# Altium schematic sheet Sheet8.SchDoc
size A4
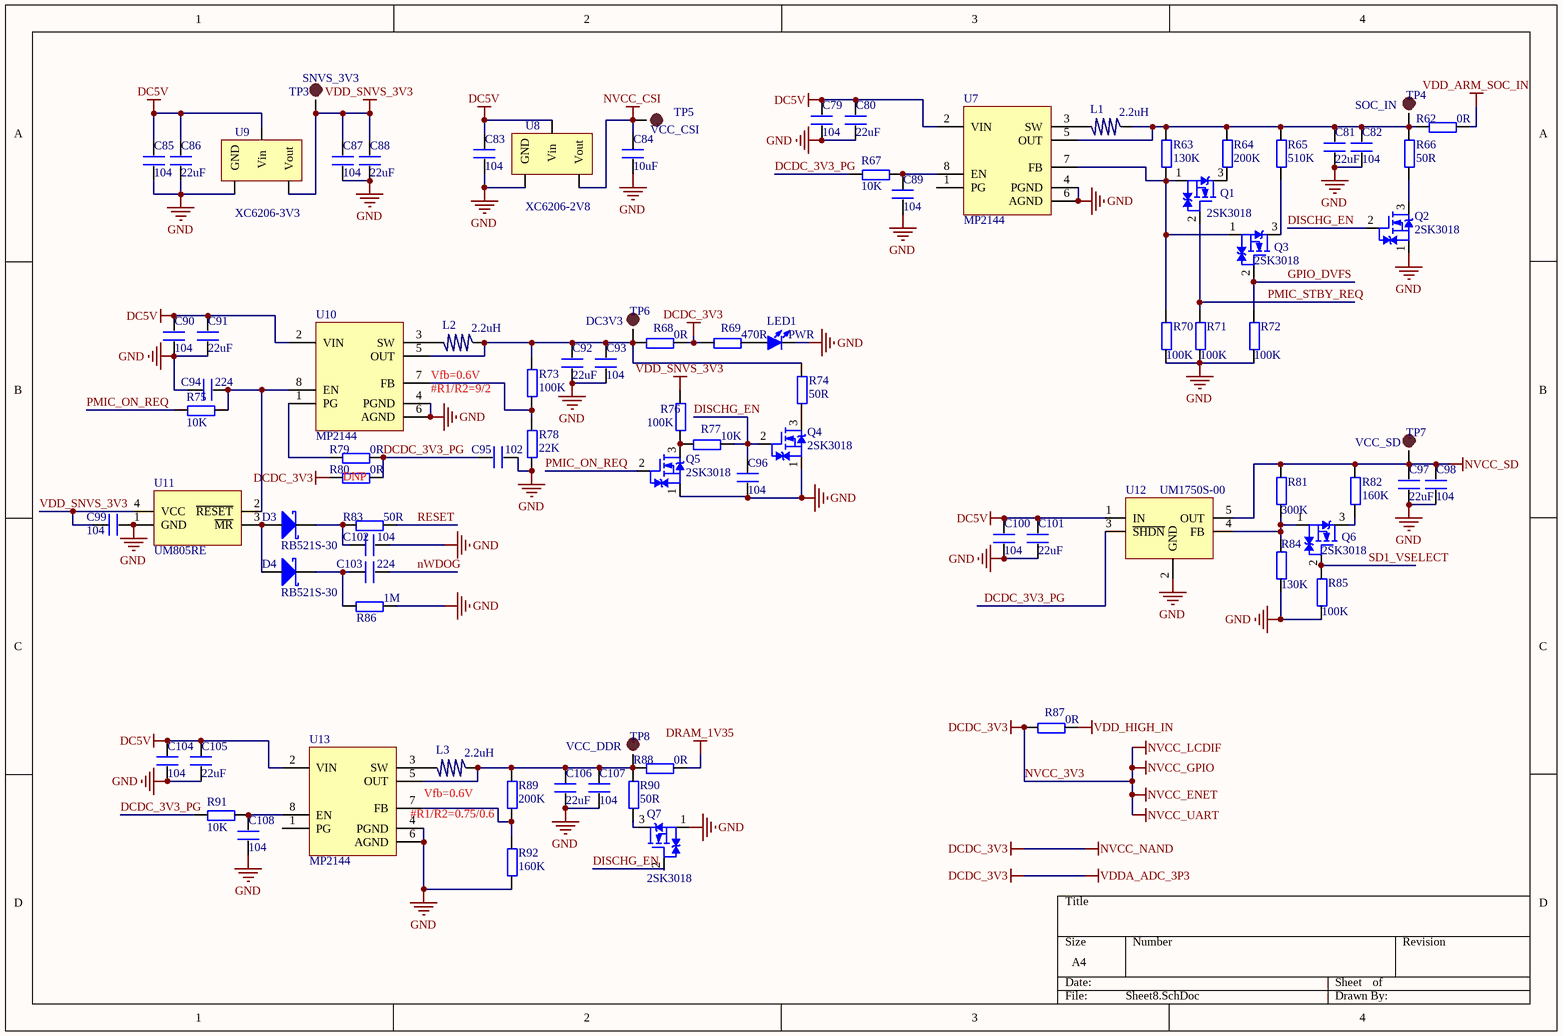
[diagram p0: Sheet8.SchDoc]

## Parts
C79  104  [C 0402]
C80  22uF  [C 0402]
C81  22uF  [C 0402]
C82  104  [C 0402]
C83  104  [C 0402]
C84  10uF  [C 0402]
C85  104  [C 0402]
C86  22uF  [C 0402]
C87  104  [C 0402]
C88  22uF  [C 0402]
C89  104  [C 0402]
C90  104  [C 0402]
C91  22uF  [C 0402]
C92  22uF  [C 0402]
C93  104  [C 0402]
C94  224  [C 0402]
C95  102  [C 0402]
C96  104  [C 0402]
C97  22uF  [C 0402]
C98  104  [C 0402]
C99  104  [C 0402]
C100  104  [C 0402]
C101  22uF  [C 0402]
C102  104  [C 0402]
C103  224  [C 0402]
C104  104  [C 0402]
C105  22uF  [C 0402]
C106  22uF  [C 0402]
C107  104  [C 0402]
C108  104  [C 0402]
D3  RB521S-30  [SOD-523]
D4  RB521S-30  [SOD-523]
L1  2.2uH  [NR3015]
L2  2.2uH  [NR3015]
L3  2.2uH  [NR3015]
LED1  PWR  [LED 0603B]
Q1  2SK3018  [SC70-3L]
Q2  2SK3018  [SC70-3L]
Q3  2SK3018  [SC70-3L]
Q4  2SK3018  [SC70-3L]
Q5  2SK3018  [SC70-3L]
Q6  2SK3018  [SC70-3L]
Q7  2SK3018  [SC70-3L]
R62  0R  [R 0402]
R63  130K  [R 0402]
R64  200K  [R 0402]
R65  510K  [R 0402]
R66  50R  [R 0402]
R67  10K  [R 0402]
R68  0R  [R 0402]
R69  470R  [R 0402]
R70  100K  [R 0402]
R71  100K  [R 0402]
R72  100K  [R 0402]
R73  100K  [R 0402]
R74  50R  [R 0402]
R75  10K  [R 0402]
R76  100K  [R 0402]
R77  10K  [R 0402]
R78  22K  [R 0402]
R79  0R  [R 0402]
R80  0R  [R 0402]
R81  300K  [R 0402]
R82  160K  [R 0402]
R83  50R  [R 0402]
R84  130K  [R 0402]
R85  100K  [R 0402]
R86  1M  [R 0402]
R87  0R  [R 0402]
R88  0R  [R 0402]
R89  200K  [R 0402]
R90  50R  [R 0402]
R91  10K  [R 0402]
R92  160K  [R 0402]
TP3  SNVS_3V3  [TP-1.0]
TP4  SOC_IN  [TP-1.0]
TP5  VCC_CSI  [TP-1.0]
TP6  DC3V3  [TP-1.0]
TP7  VCC_SD  [TP-1.0]
TP8  VCC_DDR  [TP-1.0]
U7  MP2144  [SOT23-8L]
U8  XC6206-2V8  [SOT23-3L]
U9  XC6206-3V3  [SOT23-3L]
U10  MP2144  [SOT23-8L]
U11  UM805RE  [SOT143]
U12  UM1750S-00  [SOT23-5L]
U13  MP2144  [SOT23-8L]

## Nets
DC5V: C79.2 C80.2 C83.2 C85.2 C86.2 C90.2 C91.2 C100.2 C101.2 C104.2 C105.2 U7.2(VIN) U8.2(Vin) U9.2(Vin) U10.2(VIN) U12.1(IN) U13.2(VIN)
DRAM_1V35: R88.2
GND: C79.1 C80.1 C81.1 C82.1 C83.1 C84.1 C85.1 C86.1 C87.1 C88.1 C89.1 C90.1 C91.1 C92.2 C93.2 C94.2 C95.1 C96.2 C97.1 C98.1 C99.1 C100.1 C101.1 C102.1 C104.1 C105.1 C106.2 C107.2 C108.1 LED1.2(K) Q2.1(S) Q4.1(S) Q5.1(S) Q7.1(S) R70.1 R71.1 R72.1 R78.1 R84.1 R85.1 R86.2 R92.1 U7.4(PGND) U7.6(AGND) U8.0(GND) U9.0(GND) U10.4(PGND) U10.6(AGND) U11.1(GND) U12.2(GND) U13.4(PGND) U13.6(AGND)
NVCC_3V3: R68.2 R69.1 R80.1 R87.1  [also labelled DCDC_3V3, NVCC_ENET, NVCC_GPIO, NVCC_LCDIF, NVCC_NAND, NVCC_UART, VDDA_ADC_3P3]
NVCC_CSI: C84.2 TP5.1 U8.1(Vout)
NVCC_SD: C97.2 C98.2 R81.2 R82.2 TP7.1 U12.5(OUT)
VDD_ARM_SOC_IN: R62.2
VDD_HIGH_IN: R87.2
VDD_SNVS_3V3: C87.2 C88.2 C99.2 R76.2 TP3.1 U9.1(Vout) U11.4(VCC)
DCDC_3V3_PG: C95.2 R67.1 R79.2 R80.2 R91.1 U12.3(~{SHDN})
DISCHG_EN: C96.1 Q2.2(G) Q4.2(G) Q7.2(G) R77.2
GPIO_DVFS: Q3.2(G) R72.2
nWDOG: C103.1
PMIC_ON_REQ: Q5.2(G) R75.1
PMIC_STBY_REQ: Q1.2(G) R71.2
RESET: R83.2
SD1_VSELECT: Q6.2(G) R85.2
NetC81_2: C81.2 C82.2 L1.1 R62.1 R63.2 R64.2 R65.2 R66.2 TP4.1 U7.5(OUT)
NetC89_2: C89.2 R67.2 U7.8(EN)
NetC92_1: C92.1 C93.1 L2.1 R68.1 R73.2 R74.2 TP6.1 U10.5(OUT)
NetC94_1: C94.1 R75.2 U10.8(EN) U11.2(~{RESET})
NetC102_2: C102.2 D3.2(C) R83.1
NetC103_2: C103.2 D4.2(C) R86.1
NetC106_1: C106.1 C107.1 L3.1 R88.1 R89.2 R90.2 TP8.1 U13.5(OUT)
NetC108_2: C108.2 R91.2 U13.8(EN)
NetD3_1: D3.1(A) D4.1(A) U11.3(~{MR})
NetL1_2: L1.2 U7.3(SW)
NetL2_2: L2.2 U10.3(SW)
NetL3_2: L3.2 U13.3(SW)
NetLED1_1: LED1.1(A) R69.2
NetQ1_1: Q1.1(S) Q3.1(S) R63.1 R70.2 U7.7(FB)
NetQ1_3: Q1.3(D) R64.1
NetQ2_3: Q2.3(D) R66.1
NetQ3_3: Q3.3(D) R65.1
NetQ4_3: Q4.3(D) R74.1
NetQ5_3: Q5.3(D) R76.1 R77.1
NetQ6_1: Q6.1(S) R81.1 R84.2 U12.4(FB)
NetQ6_3: Q6.3(D) R82.1
NetQ7_3: Q7.3(D) R90.1
NetR73_1: R73.1 R78.2 U10.7(FB)
NetR79_1: R79.1 U10.1(PG)
NetR89_1: R89.1 R92.2 U13.7(FB)

Not connected (* = marked no-connect by the designer): U7 1(PG); U13 1(PG)

## Notes on the sheet
- Vfb=0.6V
- #R1/R2=9/2
- (near R80) DNP
- #R1/R2=0.75/0.6

## Library data of the parts
C79-C108 = C
L1-L3 = L
LED1 = LED-SMD: 贴片LED; 版权归属: 源创客; BOM名称: 贴片LED; 学习资源: www.ooocke.com
Q1-Q7 = 2SK3018: N沟场效应管  30V,0.1A; 版权归属: 源创客; BOM名称: N沟场效应管; 学习资源: www.ooocke.com
R62-R92 = R
TP3-TP8 = TEST-POINT: 测试点
U8 = XC6206-3V3